# Altium project Drive_edu_bench.PrjPcb (part 2 of 2)

## Sheet protections.SchDoc
size 420 x 297 mm; SheetNumber: 3
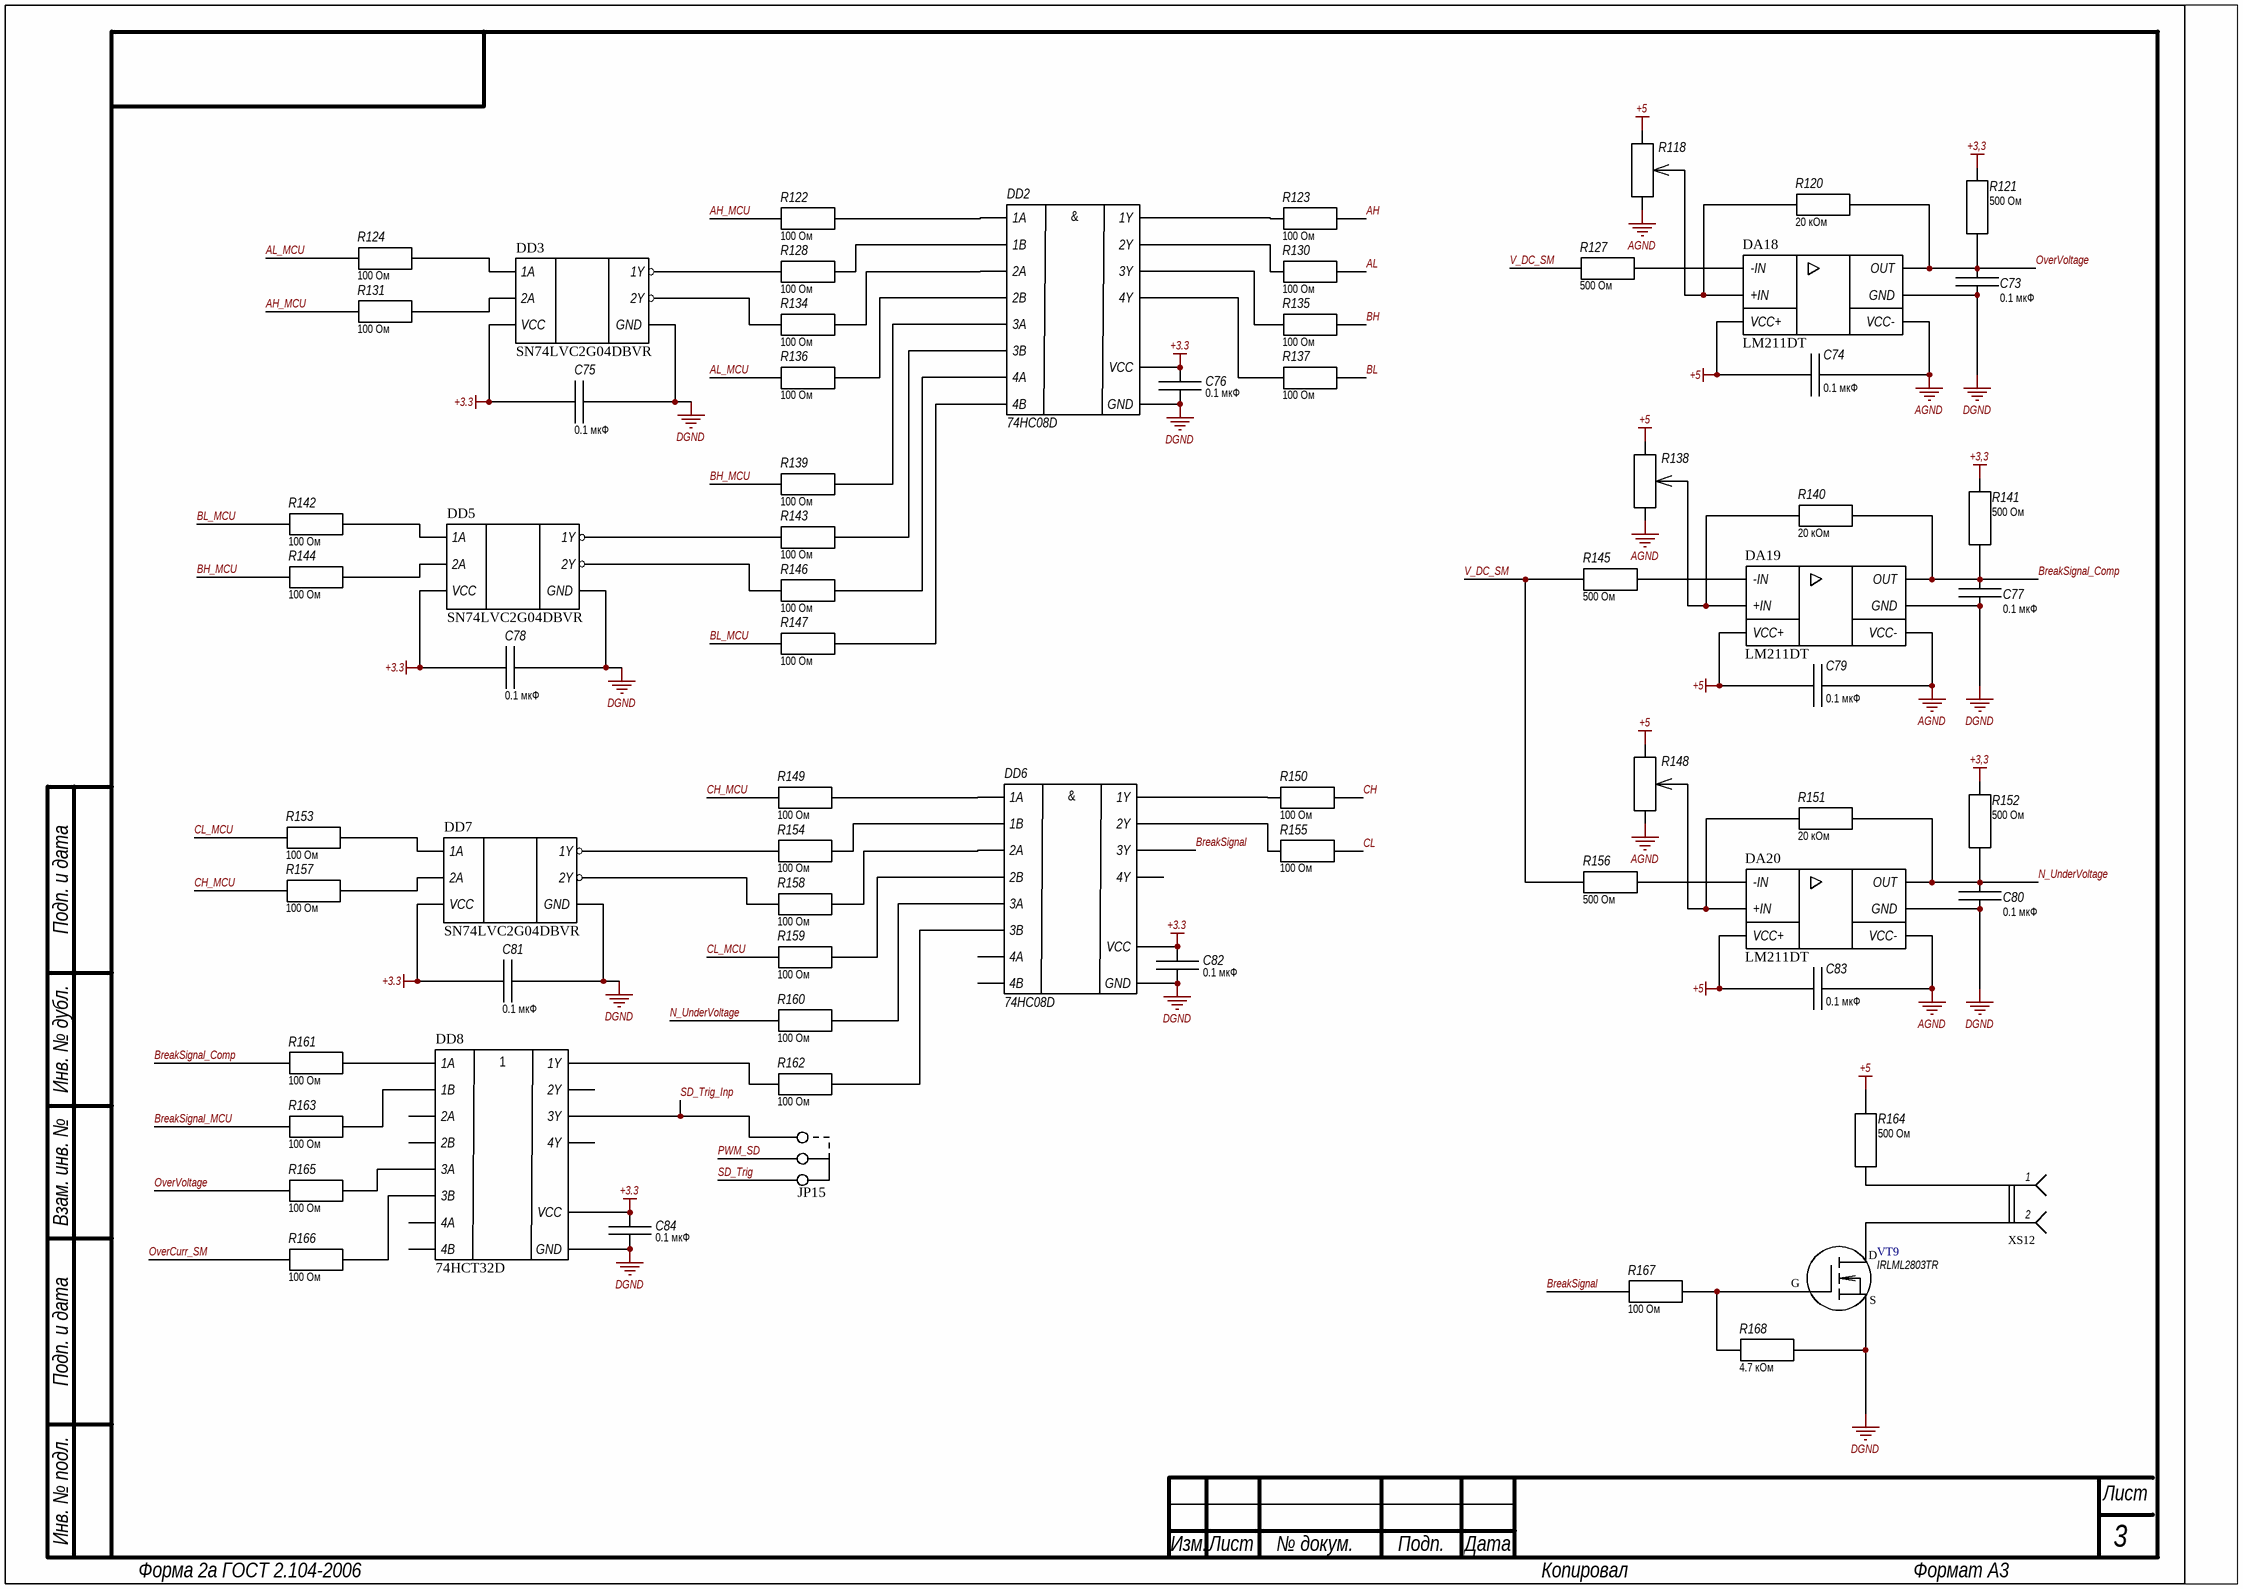
[diagram p5: protections.SchDoc]

### Parts
C73  value 0.1 мкФ  [CC0603]  (hidden comment: Capacitor)
C74  value 0.1 мкФ  [CC0603]  (hidden comment: Capacitor)
C75  value 0.1 мкФ  [CC0603]  (hidden comment: Capacitor)
C76  value 0.1 мкФ  [CC0603]  (hidden comment: Capacitor)
C77  value 0.1 мкФ  [CC0603]  (hidden comment: Capacitor)
C78  value 0.1 мкФ  [CC0603]  (hidden comment: Capacitor)
C79  value 0.1 мкФ  [CC0603]  (hidden comment: Capacitor)
C80  value 0.1 мкФ  [CC0603]  (hidden comment: Capacitor)
C81  value 0.1 мкФ  [CC0603]  (hidden comment: Capacitor)
C82  value 0.1 мкФ  [CC0603]  (hidden comment: Capacitor)
C83  value 0.1 мкФ  [CC0603]  (hidden comment: Capacitor)
C84  value 0.1 мкФ  [CC0603]  (hidden comment: Capacitor)
DA18  LM211DT  [SO8]
DA19  LM211DT  [SO8]
DA20  LM211DT  [SO8]
DD2  74HC08D  [SO14]
DD3  SN74LVC2G04DBVR  [SOT-23-6]
DD5  SN74LVC2G04DBVR  [SOT-23-6]
DD6  74HC08D  [SO14]
DD7  SN74LVC2G04DBVR  [SOT-23-6]
DD8  74HCT32D  [SO14]
JP15  Jumper  [PLS3]  (value not drawn)
R118  pot  [3296W]  (value not drawn)
R120  value 20 кОм  [RC0805]  (hidden comment: Resistor)
R121  value 500 Ом  [RC0805]  (hidden comment: Resistor)
R122  value 100 Ом  [RC0603]  (hidden comment: Resistor)
R123  value 100 Ом  [RC0603]  (hidden comment: Resistor)
R124  value 100 Ом  [RC0603]  (hidden comment: Resistor)
R127  value 500 Ом  [RC0805]  (hidden comment: Resistor)
R128  value 100 Ом  [RC0603]  (hidden comment: Resistor)
R130  value 100 Ом  [RC0603]  (hidden comment: Resistor)
R131  value 100 Ом  [RC0603]  (hidden comment: Resistor)
R134  value 100 Ом  [RC0603]  (hidden comment: Resistor)
R135  value 100 Ом  [RC0603]  (hidden comment: Resistor)
R136  value 100 Ом  [RC0603]  (hidden comment: Resistor)
R137  value 100 Ом  [RC0603]  (hidden comment: Resistor)
R138  pot  [3296W]  (value not drawn)
R139  value 100 Ом  [RC0603]  (hidden comment: Resistor)
R140  value 20 кОм  [RC0805]  (hidden comment: Resistor)
R141  value 500 Ом  [RC0805]  (hidden comment: Resistor)
R142  value 100 Ом  [RC0603]  (hidden comment: Resistor)
R143  value 100 Ом  [RC0603]  (hidden comment: Resistor)
R144  value 100 Ом  [RC0603]  (hidden comment: Resistor)
R145  value 500 Ом  [RC0805]  (hidden comment: Resistor)
R146  value 100 Ом  [RC0603]  (hidden comment: Resistor)
R147  value 100 Ом  [RC0603]  (hidden comment: Resistor)
R148  pot  [3296W]  (value not drawn)
R149  value 100 Ом  [RC0603]  (hidden comment: Resistor)
R150  value 100 Ом  [RC0603]  (hidden comment: Resistor)
R151  value 20 кОм  [RC0805]  (hidden comment: Resistor)
R152  value 500 Ом  [RC0805]  (hidden comment: Resistor)
R153  value 100 Ом  [RC0603]  (hidden comment: Resistor)
R154  value 100 Ом  [RC0603]  (hidden comment: Resistor)
R155  value 100 Ом  [RC0603]  (hidden comment: Resistor)
R156  value 500 Ом  [RC0805]  (hidden comment: Resistor)
R157  value 100 Ом  [RC0603]  (hidden comment: Resistor)
R158  value 100 Ом  [RC0603]  (hidden comment: Resistor)
R159  value 100 Ом  [RC0603]  (hidden comment: Resistor)
R160  value 100 Ом  [RC0603]  (hidden comment: Resistor)
R161  value 100 Ом  [RC0603]  (hidden comment: Resistor)
R162  value 100 Ом  [RC0603]  (hidden comment: Resistor)
R163  value 100 Ом  [RC0603]  (hidden comment: Resistor)
R164  value 500 Ом  [RC1206]  (hidden comment: Resistor)
R165  value 100 Ом  [RC0603]  (hidden comment: Resistor)
R166  value 100 Ом  [RC0603]  (hidden comment: Resistor)
R167  value 100 Ом  [RC0603]  (hidden comment: Resistor)
R168  value 4.7 кОм  [RC0603]  (hidden comment: Resistor)
VT9  IRLML2803TR  [SOT-23-3]
XS12  JST-Male-2  [JST-2]  (value not drawn)

### Nets
+3,3: R121.2 R141.2 R152.2
+3.3: C75.2 C76.2 C78.2 C81.2 C82.2 C84.2 DD2.14(VCC) DD3.5(VCC) DD5.5(VCC) DD6.14(VCC) DD7.5(VCC) DD8.14(VCC)
+5: C74.1 C79.1 C83.1 DA18.8(VCC+) DA19.8(VCC+) DA20.8(VCC+) R118.1 R138.1 R148.1 R164.1
AGND: C74.2 C79.2 C83.2 DA18.4(VCC-) DA19.4(VCC-) DA20.4(VCC-) R118.3 R138.3 R148.3
DGND: C73.1 C75.1 C76.1 C77.1 C78.1 C80.1 C81.1 C82.1 C84.1 DA18.1(GND) DA19.1(GND) DA20.1(GND) DD2.7(GND) DD3.2(GND) DD5.2(GND) DD6.7(GND) DD7.2(GND) DD8.7(GND) R168.1 VT9.S
AH: R123.1
AH_MCU: R122.2 R131.2
AL: R130.1
AL_MCU: R124.2 R136.2
BH: R135.1
BH_MCU: R139.2 R144.2
BL: R137.1
BL_MCU: R142.2 R147.2
BreakSignal: DD6.8(3Y) R167.2
BreakSignal_Comp: C77.2 DA19.7(OUT) R140.2 R141.1 R161.2
BreakSignal_MCU: R163.2
CH: R150.1
CH_MCU: R149.2 R157.2
CL: R155.1
CL_MCU: R153.2 R159.2
N_UnderVoltage: C80.2 DA20.7(OUT) R151.2 R152.1 R160.2
OverCurr_SM: R166.2
OverVoltage: C73.2 DA18.7(OUT) R120.2 R121.1 R165.2
PWM_SD: JP15.2
SD_Trig: JP15.3
SD_Trig_Inp: DD8.8(3Y) JP15.1
V_DC_SM: R127.1 R145.1 R156.1
NetDA18_2: DA18.2(+IN) R118.2 R120.1
NetDA18_3: DA18.3(-IN) R127.2
NetDA19_2: DA19.2(+IN) R138.2 R140.1
NetDA19_3: DA19.3(-IN) R145.2
NetDA20_2: DA20.2(+IN) R148.2 R151.1
NetDA20_3: DA20.3(-IN) R156.2
NetDD2_1: DD2.1(1A) R122.1
NetDD2_2: DD2.2(1B) R128.1
NetDD2_3: DD2.3(1Y) R123.2
NetDD2_4: DD2.4(2A) R134.1
NetDD2_5: DD2.5(2B) R136.1
NetDD2_6: DD2.6(2Y) R130.2
NetDD2_8: DD2.8(3Y) R135.2
NetDD2_9: DD2.9(3A) R139.1
NetDD2_10: DD2.10(3B) R143.1
NetDD2_11: DD2.11(4Y) R137.2
NetDD2_12: DD2.12(4A) R146.1
NetDD2_13: DD2.13(4B) R147.1
NetDD3_1: DD3.1(1A) R124.1
NetDD3_3: DD3.3(2A) R131.1
NetDD3_4: DD3.4(2Y) R134.2
NetDD3_6: DD3.6(1Y) R128.2
NetDD5_1: DD5.1(1A) R142.1
NetDD5_3: DD5.3(2A) R144.1
NetDD5_4: DD5.4(2Y) R146.2
NetDD5_6: DD5.6(1Y) R143.2
NetDD6_1: DD6.1(1A) R149.1
NetDD6_2: DD6.2(1B) R154.1
NetDD6_3: DD6.3(1Y) R150.2
NetDD6_4: DD6.4(2A) R158.1
NetDD6_5: DD6.5(2B) R159.1
NetDD6_6: DD6.6(2Y) R155.2
NetDD6_9: DD6.9(3A) R160.1
NetDD6_10: DD6.10(3B) R162.1
NetDD7_1: DD7.1(1A) R153.1
NetDD7_3: DD7.3(2A) R157.1
NetDD7_4: DD7.4(2Y) R158.2
NetDD7_6: DD7.6(1Y) R154.2
NetDD8_1: DD8.1(1A) R161.1
NetDD8_2: DD8.2(1B) R163.1
NetDD8_3: DD8.3(1Y) R162.2
NetDD8_9: DD8.9(3A) R165.1
NetDD8_10: DD8.10(3B) R166.1
NetR164_2: R164.2 XS12.1
NetR167_1: R167.1 R168.2 VT9.G
NetVT9_D: VT9.D XS12.2

Not connected (* = marked no-connect by the designer): DD6 11(4Y) 12(4A) 13(4B); DD8 4(2A) 5(2B) 6(2Y) 11(4Y) 12(4A) 13(4B)

### Notes on the sheet
- Подп. и дата
- Инв. № дубл.
- Взам. инв. №
- Инв. № подл.
- Изм.
- Лист
- № докум.
- Подп.
- Дата
- Форма 2а ГОСТ 2.104-2006
- Копировал
- Формат А3
- (in symbol 74HC08D) &

### Library data of the parts
C73-C84 = Capacitor: Voltage: 16В; ComponentLink1Description: Product link; ComponentLink1URL: *; Name: CC0603; GOST_Name_1: =Name; GOST_Name_2: 16В; GOST_Name_3: 0.1 мкФ; GOST_Name_0: -
DA18-DA20 = LM211DT: Компаратор; GOST_Name_1: LM211DT, ф ST Microelectronics; ComponentLink1Description: Product link; ComponentLink1URL: https://www.promelec.ru/product/40196/
DD2 DD6 = 74HC08D: Логическая ИС, логическая функция 2И [SO-14]; Name: 74HC08D, ф Nexperia B.V.; ComponentLink1Description: Product link; ComponentLink1URL: https://www.chipdip.ru/product/74hc08d
DD3 DD5 DD7 = SN74LVC2G04DBVR: Двойной инвертер [SOT-23-6]; Name: 74LVC2G04GW, ф Nexperia B.V.; ComponentLink1Description: Product link; ComponentLink1URL: https://www.chipdip.ru/product/74lvc2g04gw-125
DD8 = 74HCT32D: Логическая ИС, логическая функция 2ИЛИ [SO-14]; Name: 74HCT32D, ф Nexperia B.V.; ComponentLink1Description: Product link; ComponentLink1URL: https://www.chipdip.ru/product/74hct32d-653-nexperia
R118 R138 R148 = pot: Name: 10 кОм ± 20% 0,5 Вт, 3296W-1-103LF, ф. Bourns; ComponentLink1Description: Product link; GOST_Name_1: 10 кОм ± 20% 0,5 Вт, 3296W-1-103LF, ф. Bourns
  R138 R148: ComponentLink1URL: https://www.promelec.ru/product/452500/
R120 R121 R127 R140 R141 R145 R151 R152 R156 = Resistor: Power: 125 мВт; ComponentLink1Description: Product link; ComponentLink1URL: *; Name: RC0805; GOST_Name_1: =Name; GOST_Name_2: 125 мВт; GOST_Name_0: -
  R120 R140 R151: GOST_Name_3: 20 кОм
  R121 R127 R141 R145 R152 R156: GOST_Name_3: 500 Ом
R122-R124 R128 R130 R131 R134-R137 R139 R142-R144 R146 R147 R149 R150 R153-R155 R157-R163 R165-R168 = Resistor: Power: 100 мВт; ComponentLink1Description: Product link; ComponentLink1URL: *; Name: RC0603; GOST_Name_1: =Name; GOST_Name_2: 100 мВт; GOST_Name_0: -
  R122-R124 R128 R130 R131 R134-R137 R139 R142-R144 R146 R147 R149 R150 R153-R155 R157-R163 R165-R167: GOST_Name_3: 100 Ом
  R168: GOST_Name_3: 4.7 кОм
R164 = Resistor: Power: 250 мВт; ComponentLink1Description: Product link; ComponentLink1URL: *; Name: RC1206; GOST_Name_1: =Name; GOST_Name_2: 250 мВт; GOST_Name_3: 500 Ом; GOST_Name_0: -
VT9 = N-MOSFET: pin to pad: D>3 G>1 S>2; GOST_Name_1: IRLML2803TR; ComponentLink1Description: Product link; ComponentLink1URL: https://www.chipdip.ru/product/irlml2803tr-umw?utm_source=direct&utm_medium=cpc&position_type=premium|k50id|010000005534644_5534644|cid|108406362|gid|5417216457|aid|15932497800|src|search_none&utm_campaign=Y_dinamicheskaya&utm_content=text1_ya&utm_term=&yclid=717148778588012543
XS12 = JST-Male-2: Name: JST-2.54 x2; GOST_Name_1: JST-2.54 x2
JP15 = Jumper: ComponentLink1Description: Product link; ComponentLink1URL: https://www.chipdip.ru/product/stps2h100a-2

## Sheet protections_1.SchDoc
size 420 x 297 mm; SheetNumber: 3
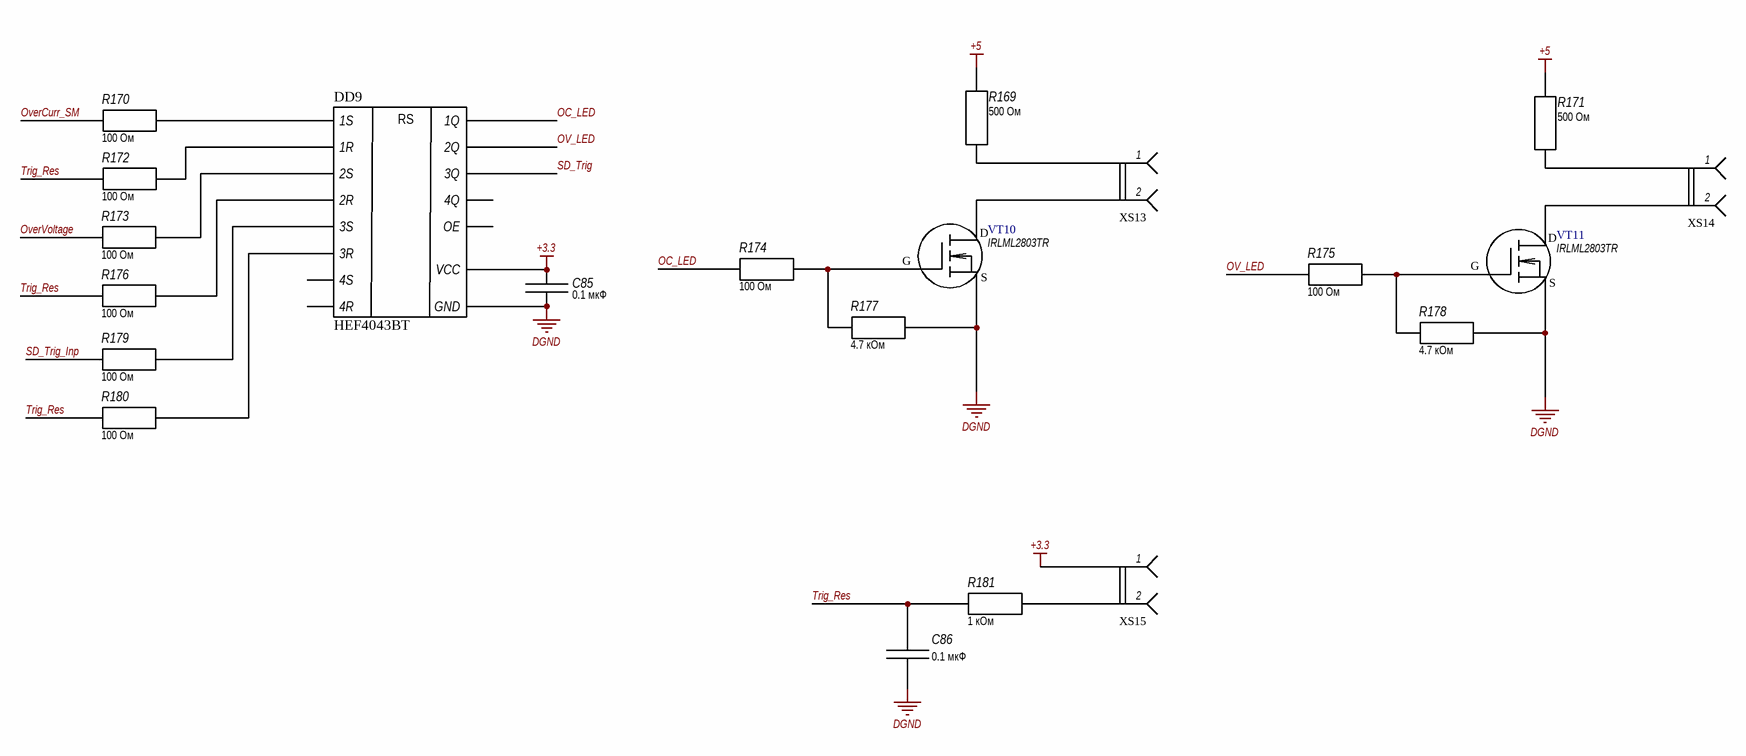
[diagram p6: protections_1.SchDoc]

### Parts
C85  value 0.1 мкФ  [CC0603]  (hidden comment: Capacitor)
C86  value 0.1 мкФ  [CC0603]  (hidden comment: Capacitor)
DD9  HEF4043BT  [SO16]
R169  value 500 Ом  [RC1206]  (hidden comment: Resistor)
R170  value 100 Ом  [RC0603]  (hidden comment: Resistor)
R171  value 500 Ом  [RC1206]  (hidden comment: Resistor)
R172  value 100 Ом  [RC0603]  (hidden comment: Resistor)
R173  value 100 Ом  [RC0603]  (hidden comment: Resistor)
R174  value 100 Ом  [RC0603]  (hidden comment: Resistor)
R175  value 100 Ом  [RC0603]  (hidden comment: Resistor)
R176  value 100 Ом  [RC0603]  (hidden comment: Resistor)
R177  value 4.7 кОм  [RC0603]  (hidden comment: Resistor)
R178  value 4.7 кОм  [RC0603]  (hidden comment: Resistor)
R179  value 100 Ом  [RC0603]  (hidden comment: Resistor)
R180  value 100 Ом  [RC0603]  (hidden comment: Resistor)
R181  value 1 кОм  [RC0603]  (hidden comment: Resistor)
VT10  IRLML2803TR  [SOT-23-3]
VT11  IRLML2803TR  [SOT-23-3]
XS13  JST-Male-2  [JST-2]  (value not drawn)
XS14  JST-Male-2  [JST-2]  (value not drawn)
XS15  JST-Male-2  [JST-2]  (value not drawn)

### Nets
+3.3: C85.2 DD9.16(VCC) XS15.1
+5: R169.1 R171.1
DGND: C85.1 C86.1 DD9.8(GND) R177.1 R178.1 VT10.S VT11.S
OC_LED: DD9.2(1Q) R174.2
OV_LED: DD9.9(2Q) R175.2
OverCurr_SM: R170.2
OverVoltage: R173.2
SD_Trig: DD9.10(3Q)
SD_Trig_Inp: R179.2
Trig_Res: C86.2 R172.2 R176.2 R180.2 R181.1
NetDD9_3: DD9.3(1R) R172.1
NetDD9_4: DD9.4(1S) R170.1
NetDD9_6: DD9.6(2S) R173.1
NetDD9_7: DD9.7(2R) R176.1
NetDD9_11: DD9.11(3R) R180.1
NetDD9_12: DD9.12(3S) R179.1
NetR169_2: R169.2 XS13.1
NetR171_2: R171.2 XS14.1
NetR174_1: R174.1 R177.2 VT10.G
NetR175_1: R175.1 R178.2 VT11.G
NetR181_2: R181.2 XS15.2
NetVT10_D: VT10.D XS13.2
NetVT11_D: VT11.D XS14.2

Not connected (* = marked no-connect by the designer): DD9 1(4Q) 5(OE) 14(4S) 15(4R)

### Notes on the sheet
- Подп. и дата
- Инв. № дубл.
- Взам. инв. №
- Инв. № подл.
- Изм.
- Лист
- № докум.
- Подп.
- Дата
- Форма 2а ГОСТ 2.104-2006
- Копировал
- Формат А3
- (in symbol HEF4043BT) RS

### Library data of the parts
C85 = Capacitor: Voltage: 16В; ComponentLink1Description: Product link; ComponentLink1URL: *; Name: CC0603; GOST_Name_1: =Name; GOST_Name_2: 16В; GOST_Name_3: 0.1 мкФ; GOST_Name_0: -
C86 = Capacitor: Voltage: 50 В; ComponentLink1Description: Product link; ComponentLink1URL: *; Name: CC0603; GOST_Name_1: =Name; GOST_Name_2: 50 В; GOST_Name_3: 0.1 мкФ; GOST_Name_0: -
DD9 = HEF4043BT: Триггер RS-типа х 4 [SOIC-16]; Name: HEF4043BT, ф Nexperia B.V.; ComponentLink1Description: Product link; ComponentLink1URL: https://www.chipdip.ru/product/hef4043bt-652-nexperia
R169 R171 = Resistor: Power: 250 мВт; ComponentLink1Description: Product link; ComponentLink1URL: *; Name: RC1206; GOST_Name_1: =Name; GOST_Name_2: 250 мВт; GOST_Name_3: 500 Ом; GOST_Name_0: -
R170 R172-R181 = Resistor: Power: 100 мВт; ComponentLink1Description: Product link; ComponentLink1URL: *; Name: RC0603; GOST_Name_1: =Name; GOST_Name_2: 100 мВт; GOST_Name_0: -
  R170 R172-R176 R179 R180: GOST_Name_3: 100 Ом
  R177 R178: GOST_Name_3: 4.7 кОм
  R181: GOST_Name_3: 1 кОм
VT10 VT11 = N-MOSFET: pin to pad: D>3 G>1 S>2; GOST_Name_1: IRLML2803TR; ComponentLink1Description: Product link; ComponentLink1URL: https://www.chipdip.ru/product/irlml2803tr-umw?utm_source=direct&utm_medium=cpc&position_type=premium|k50id|010000005534644_5534644|cid|108406362|gid|5417216457|aid|15932497800|src|search_none&utm_campaign=Y_dinamicheskaya&utm_content=text1_ya&utm_term=&yclid=717148778588012543
XS13-XS15 = JST-Male-2: Name: JST-2.54 x2; GOST_Name_1: JST-2.54 x2

## Nets that join several sheets
+3,3: Voltege_inverter (R27.2), protections (R121.2 R141.2 R152.2)
+3.3: Voltege_inverter (6 pins), power (7 pins), Control_part (XS1.1 XS3.1 XS7.1), position_sensors (JP6.1 JP7.1 XS9.1), Communication_interfaces (C71.1 C72.2 DD1.3), protections (12 pins), protections_1 (C85.2 DD9.16 XS15.1)
+3.3_ref: Voltege_inverter (DA1.7 DA3.7 DA4.7), power (C48.1 C49.1 JP4.2)
+5: Voltege_inverter (11 pins), power (C50.1 C52.1 DA12.1 DA13.3), Control_part (DD4.CN11_6 XS5.1 XS6.1), Communication_interfaces (DA17.5 R106.2 R114.1), protections (10 pins), protections_1 (R169.1 R171.1)
+5V: power (C32.2 C34.1 L1.2 R44.1), position_sensors (JP6.3 JP7.3)
+12: Voltege_inverter (9 pins), power (C30.2 DA9.6)
+VM_SM: Voltege_inverter (6 pins), power (10 pins)
AGND: Voltege_inverter (15 pins), power (10 pins), Control_part (DD4.CN12_32), position_sensors (C57.1 R74.2), protections (9 pins)
DGND: Voltege_inverter (8 pins), power (26 pins), Control_part (25 pins), position_sensors (33 pins), Communication_interfaces (13 pins), protections (20 pins), protections_1 (7 pins)
Power_GND: Voltege_inverter (6 pins), power (12 pins)
AH: Voltege_inverter (DA2.10), protections (R123.1)
AH_MCU: Control_part (DD4.CN12_52), protections (R122.2 R131.2)
AL: Voltege_inverter (DA2.12), protections (R130.1)
AL_MCU: Control_part (DD4.CN12_40), protections (R124.2 R136.2)
BEMF_U: power (JP1.2), Control_part (DD4.CN12_13)
BEMF_V: power (JP2.2), Control_part (DD4.CN12_24)
BEMF_W: power (JP3.2), Control_part (DD4.CN12_58)
BH: Voltege_inverter (DA5.10), protections (R135.1)
BH_MCU: Control_part (DD4.CN12_56), protections (R139.2 R144.2)
BL: Voltege_inverter (DA5.12), protections (R137.1)
BL_MCU: Control_part (DD4.CN12_47), protections (R142.2 R147.2)
BreakSignal: power (R41.2), protections (DD6.8 R167.2)
CAN_RX: Control_part (DD4.CN11_57), Communication_interfaces (R108.2)
CAN_TX: Control_part (DD4.CN11_55), Communication_interfaces (R98.2)
CH: Voltege_inverter (DA8.10), protections (R150.1)
CH_MCU: Control_part (DD4.CN12_55), protections (R149.2 R157.2)
CL: Voltege_inverter (DA8.12), protections (R155.1)
CL_MCU: Control_part (DD4.CN12_49), protections (R153.2 R159.2)
Current_U: Voltege_inverter (DA1.5), Control_part (R113.1)
Current_V: Voltege_inverter (DA3.5), Control_part (R107.1)
Current_W: Voltege_inverter (DA4.5), Control_part (R116.1)
DC_Current_SM: Voltege_inverter (R32.2), Control_part (DD4.CN11_35)
ENC_A: Control_part (DD4.CN11_17), position_sensors (JP5.2)
ENC_B: Control_part (DD4.CN12_31), position_sensors (JP11.2)
ENC_Z: Control_part (DD4.CN12_25), position_sensors (JP12.2)
HALL_A: Control_part (DD4.CN12_43), position_sensors (C68.2 R90.1 R93.1 VD27.A)
HALL_B: Control_part (DD4.CN12_41), position_sensors (C69.2 R91.1 R94.1 VD28.A)
HALL_C: Control_part (DD4.CN12_46), position_sensors (C70.2 R92.1 R95.1 VD29.A)
OverCurr_SM: Voltege_inverter (C23.2 DA7.7 R26.2 R27.1), protections (R166.2), protections_1 (R170.2)
OverVoltage: protections (5 pins), protections_1 (R173.2)
PWM_SD: Voltege_inverter (R7.2 R19.2 R36.2), Control_part (R119.1), protections (JP15.2)
RS485_RX: Control_part (DD4.CN11_43), Communication_interfaces (R97.2)
RS485_TX: Control_part (DD4.CN11_41), Communication_interfaces (R104.2 R115.2)
SD_Trig: protections (JP15.3), protections_1 (DD9.10)
SD_Trig_Inp: protections (DD8.8 JP15.1), protections_1 (R179.2)
Temp_SM: Control_part (DD4.CN12_36), position_sensors (C57.2 R74.1 XS9.2)
U: Voltege_inverter (11 pins), power (R46.1)
U_Out: Voltege_inverter (R2.2 RS1.2 RS2.2), power (X5.1)
V: Voltege_inverter (11 pins), power (R52.1)
V_DC_SM: power (C46.2 R55.2 R58.1), Control_part (DD4.CN11_11), protections (R127.1 R145.1 R156.1)
V_Out: Voltege_inverter (R10.2 RS3.2 RS4.2), power (X6.1)
W: Voltege_inverter (11 pins), power (R56.1)
W_Out: Voltege_inverter (R15.2 RS5.2 RS6.2), power (X7.1)